# Altium schematic sheet main.SchDoc
size A4
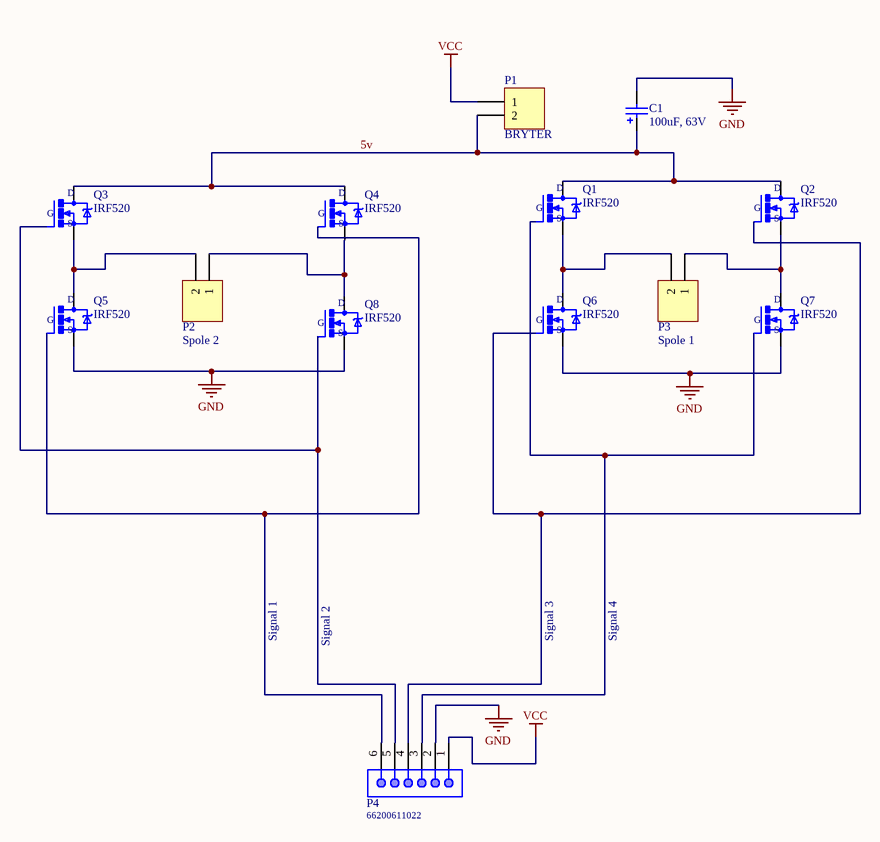
[diagram p0: main.SchDoc]

## Parts
C1  100uF, 63V  [WCAP-ATG8_D10H12.5]
P1  BRYTER  [HDR1X2H]
P2  Spole 2  [HDR1X2H]
P3  Spole 1  [HDR1X2H]
P4  66200611022  [66200611022]
Q1  IRF520  [TO220BV]
Q2  IRF520  [TO220BV]
Q3  IRF520  [TO220BV]
Q4  IRF520  [TO220BV]
Q5  IRF520  [TO220BV]
Q6  IRF520  [TO220BV]
Q7  IRF520  [TO220BV]
Q8  IRF520  [TO220BV]

## Nets
GND: C1.2(N) P4.2 Q5.S Q6.S Q7.S Q8.S
VCC: P1.1 P4.1
5v: C1.1(P) P1.2 Q1.D Q2.D Q3.D Q4.D
NetP2_1: P2.1 Q4.S Q8.D
NetP2_2: P2.2 Q3.S Q5.D
NetP3_1: P3.1 Q2.S Q7.D
NetP3_2: P3.2 Q1.S Q6.D
NetP4_3: P4.3 Q1.G Q7.G
NetP4_4: P4.4 Q2.G Q6.G
NetP4_5: P4.5 Q3.G Q8.G
NetP4_6: P4.6 Q4.G Q5.G

## Notes on the sheet
- Signal 1
- Signal 2
- Signal 3
- Signal 4

## Library data of the parts
C1 = 860010775014: WCAP-ATG8 Aluminum Electrolytic Capacitor, Radial, THT, D10xH12.5, 100uF, 63V; Manufacturer: Wurth Elektronik; Ripple Current: 330mA; Rated Voltage: 63VDC; Technical Reference: ATBF125101M063DSPA9B000; Leakage Current: 63uA; Endurance: 2000h; Dissipation Factor: 9%; Capacitance Tolerance: +/-20%; ComponentLink2Description: Datasheet; Published Date: October 2020; Packaging: Ammo Pack; Operating Temperature: -40 to +85degC; Mounting Technology: THT; Manufacturer Part Number: 860010775014; Height: 12.5mm; Diameter: 10mm; ComponentLink2URL: https://www.we-online.com/catalog/datasheet/860010775014.pdf; ComponentLink1URL: http://www.we-online.de; ComponentLink1Description: Manufacturer; Capacitance: 100uF
P1-P3 = Header 2H: Header, 2-Pin, Right Angle / BRYTER; LatestRevisionDate: 17-Jul-2002; LatestRevisionNote: Re-released for DXP Platform.; Publisher: Altium Limited
P4 = 66200611022: THT Male Header WR-MPC3, with Snap-in Plastic Pegs, Right Angled, Single Row, pitch 3 mm, 6 pins; Pitch: 3 mm; Working Voltage: 250 VAC; Contact Resistance: 10 mOhm; Pin Number: 6; ComponentLink1Description: Manufacturer; ComponentLink1URL: http://www.we-online.de; ComponentLink2Description: Datasheet; ComponentLink2URL: https://katalog.we-online.de/em/datasheet/6620xx11022.pdf; Part Number: 66200611022; Published Date: September 2018; Publisher: Wurth Elektronik; Operating Temperature: -40 to 105 degC; Packaging: Tube; Gender: Male; Mounting Technology: THT; Orientation: Right Angled
Q1-Q8 = IRF520: N-Channel 100V 9.2A _Tc_ 60W _Tc_ Through Hole TO-220AB; MF: Vishay Siliconix; MP: IRF520; Availability: Unavailable; Package: TO-220 Vishay Siliconix; Value: *; Price: None; SnapEDA_Link: https://www.snapeda.com/parts/IRF520/Vishay%20Siliconix/view-part/522447/?ref=snap